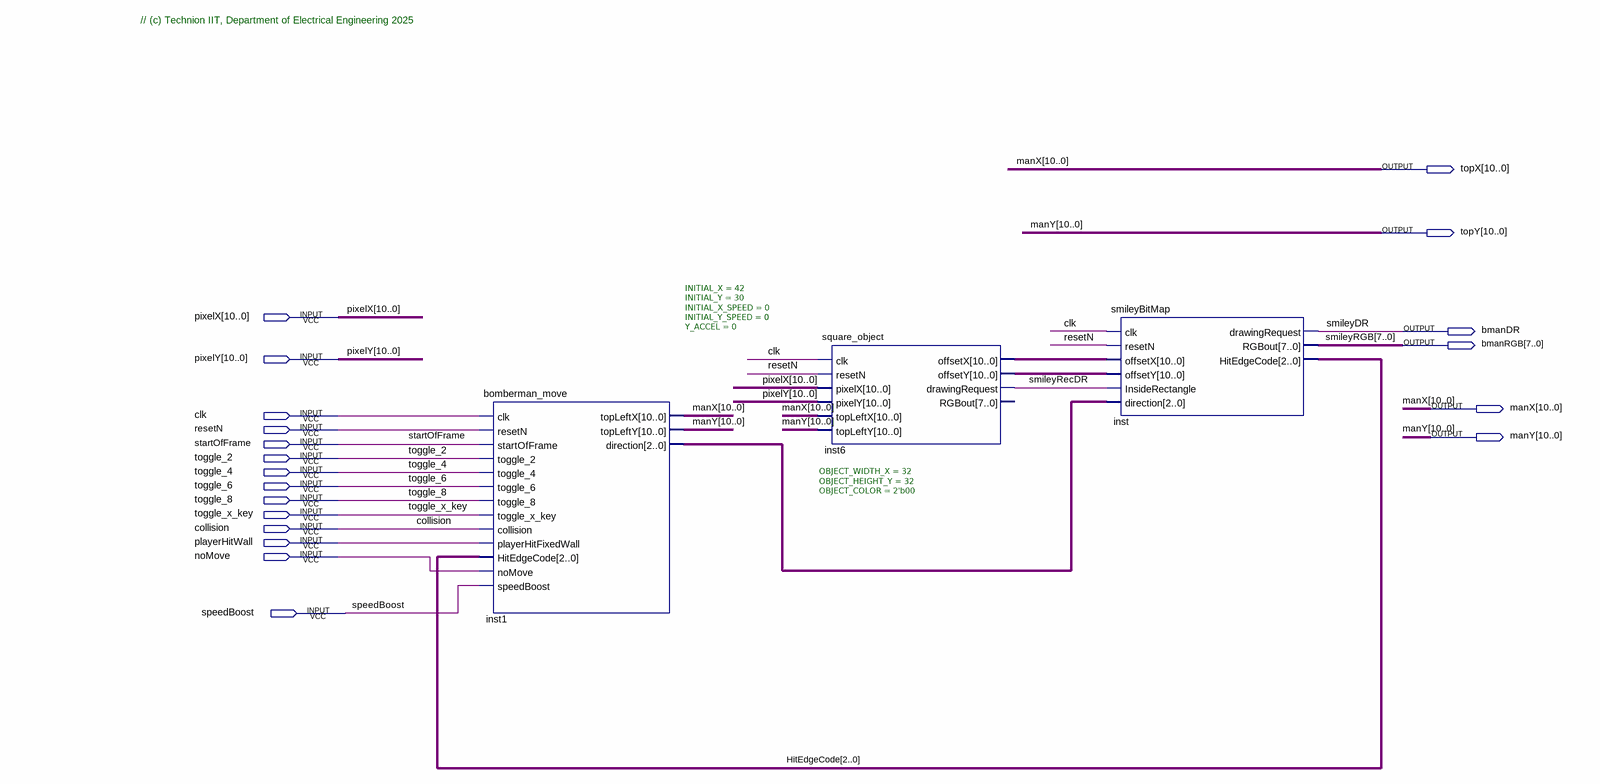
[diagram p0: schematic sheet]
// Quartus schematic Bomberman_Block_T.bdf as structural Verilog: 3 symbols, 20 pins
module Bomberman_Block_T (
  input  [10:0] pixelX,
  input  [10:0] pixelY,
  input  clk,
  input  resetN,
  input  startOfFrame,
  input  toggle_2,
  input  toggle_4,
  input  toggle_6,
  input  toggle_8,
  input  toggle_x_key,
  input  collision,
  input  playerHitWall,
  input  noMove,
  input  speedBoost,
  output [10:0] topX,
  output [10:0] topY,
  output bmanDR,
  output [7:0] bmanRGB,
  output [10:0] manX,
  output [10:0] manY
);

  wire smileyRecDR;
  wire [2:0] HitEdgeCode, inst1_direction;
  wire [10:0] inst6_offsetx, inst6_offsety;

  bomberman_move #(.INITIAL_X(42), .INITIAL_Y(30), .INITIAL_X_SPEED(0), .INITIAL_Y_SPEED(0), .Y_ACCEL(0)) inst1 (
    .clk(clk), .resetN(resetN), .startOfFrame(startOfFrame), .toggle_2(toggle_2), .toggle_4(toggle_4),
    .toggle_6(toggle_6), .toggle_8(toggle_8), .toggle_x_key(toggle_x_key), .collision(collision),
    .playerHitFixedWall(playerHitWall), .HitEdgeCode(HitEdgeCode), .noMove(noMove), .speedBoost(speedBoost),
    .topLeftX(manX), .topLeftY(manY), .direction(inst1_direction));
  square_object #(.OBJECT_WIDTH_X(32), .OBJECT_HEIGHT_Y(32), .OBJECT_COLOR(2'b00)) inst6 (
    .clk(clk), .resetN(resetN), .pixelX(pixelX), .pixelY(pixelY), .topLeftX(manX), .topLeftY(manY),
    .offsetX(inst6_offsetx), .offsetY(inst6_offsety), .drawingRequest(smileyRecDR));  // open: RGBout
  smileyBitMap inst (
    .clk(clk), .resetN(resetN), .offsetX(inst6_offsetx), .offsetY(inst6_offsety),
    .InsideRectangle(smileyRecDR), .direction(inst1_direction), .drawingRequest(bmanDR), .RGBout(bmanRGB),
    .HitEdgeCode(HitEdgeCode));

  assign topX = manX;
  assign topY = manY;

  // Other names for the same wires on the sheet: smileyDR = bmanDR; smileyRGB[7:0] = bmanRGB

  // Notes on the sheet:
  //   // (c) Technion IIT, Department of Electrical Engineering 2025
endmodule
